# EAGLE board Mixer (EAGLE 9.6.2)
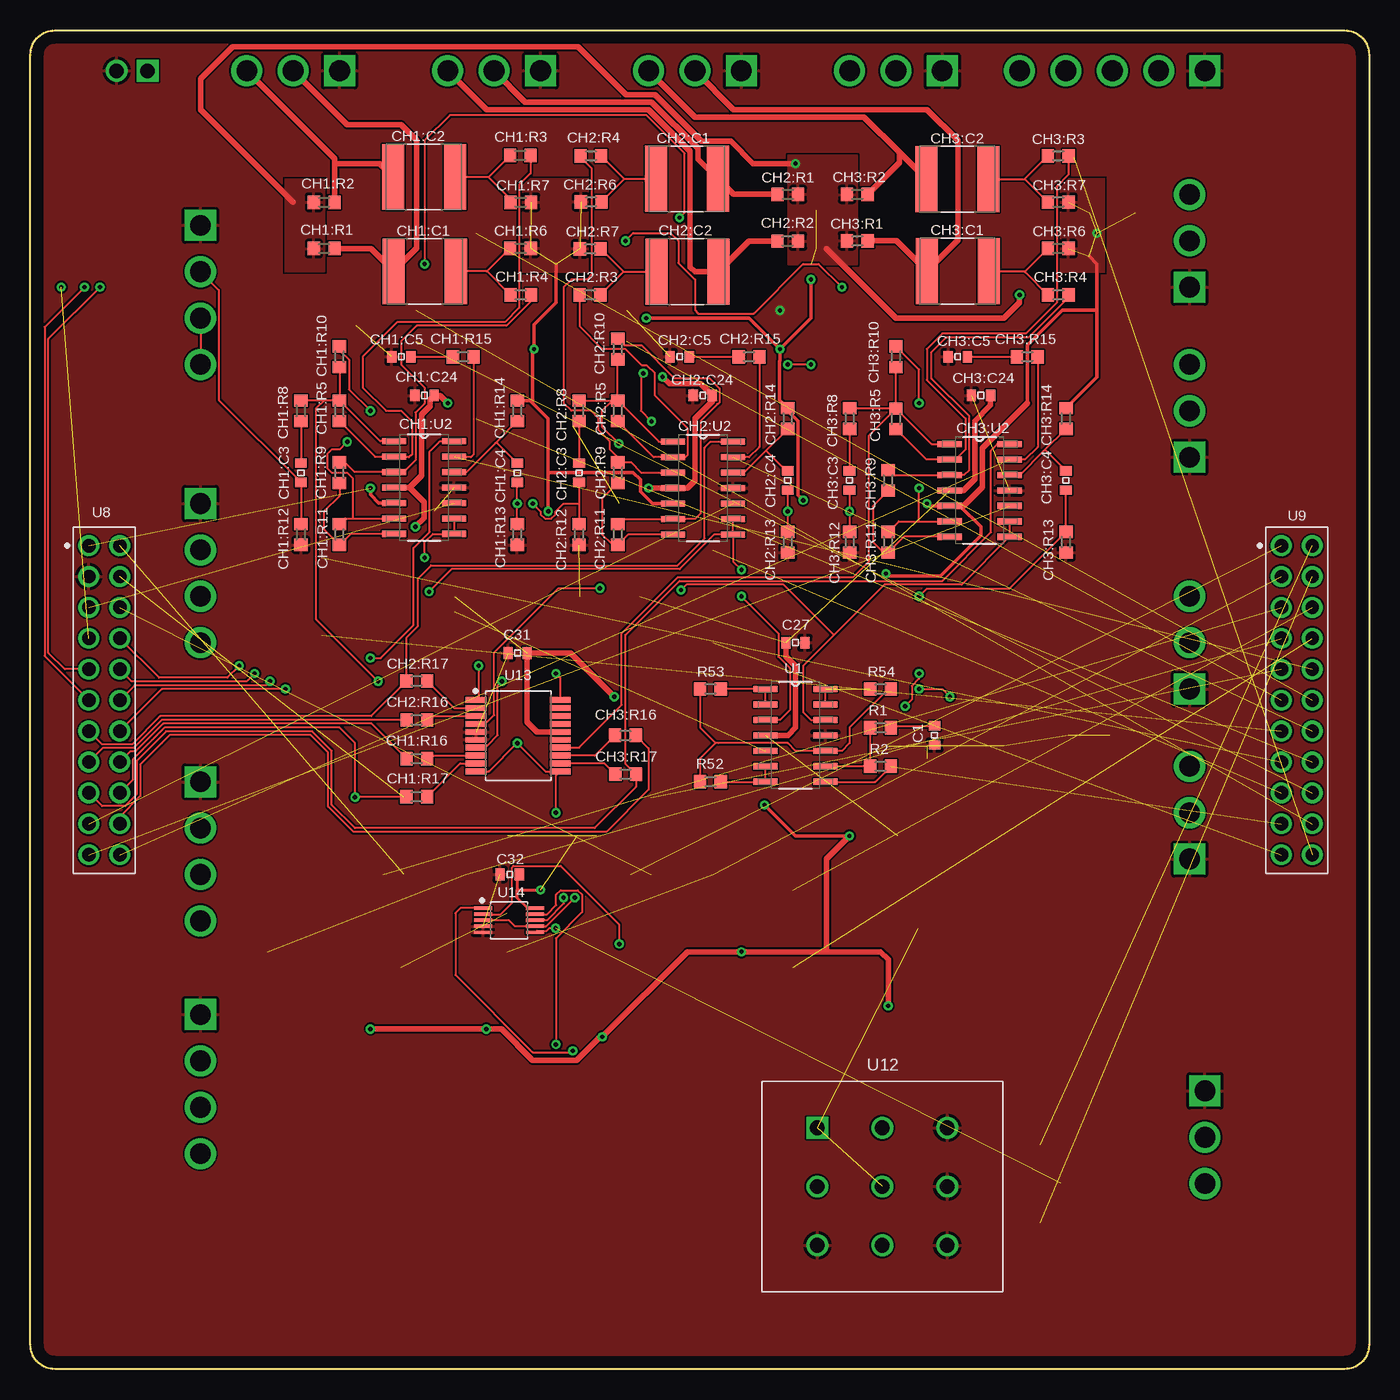
[diagram p6: board, top side]
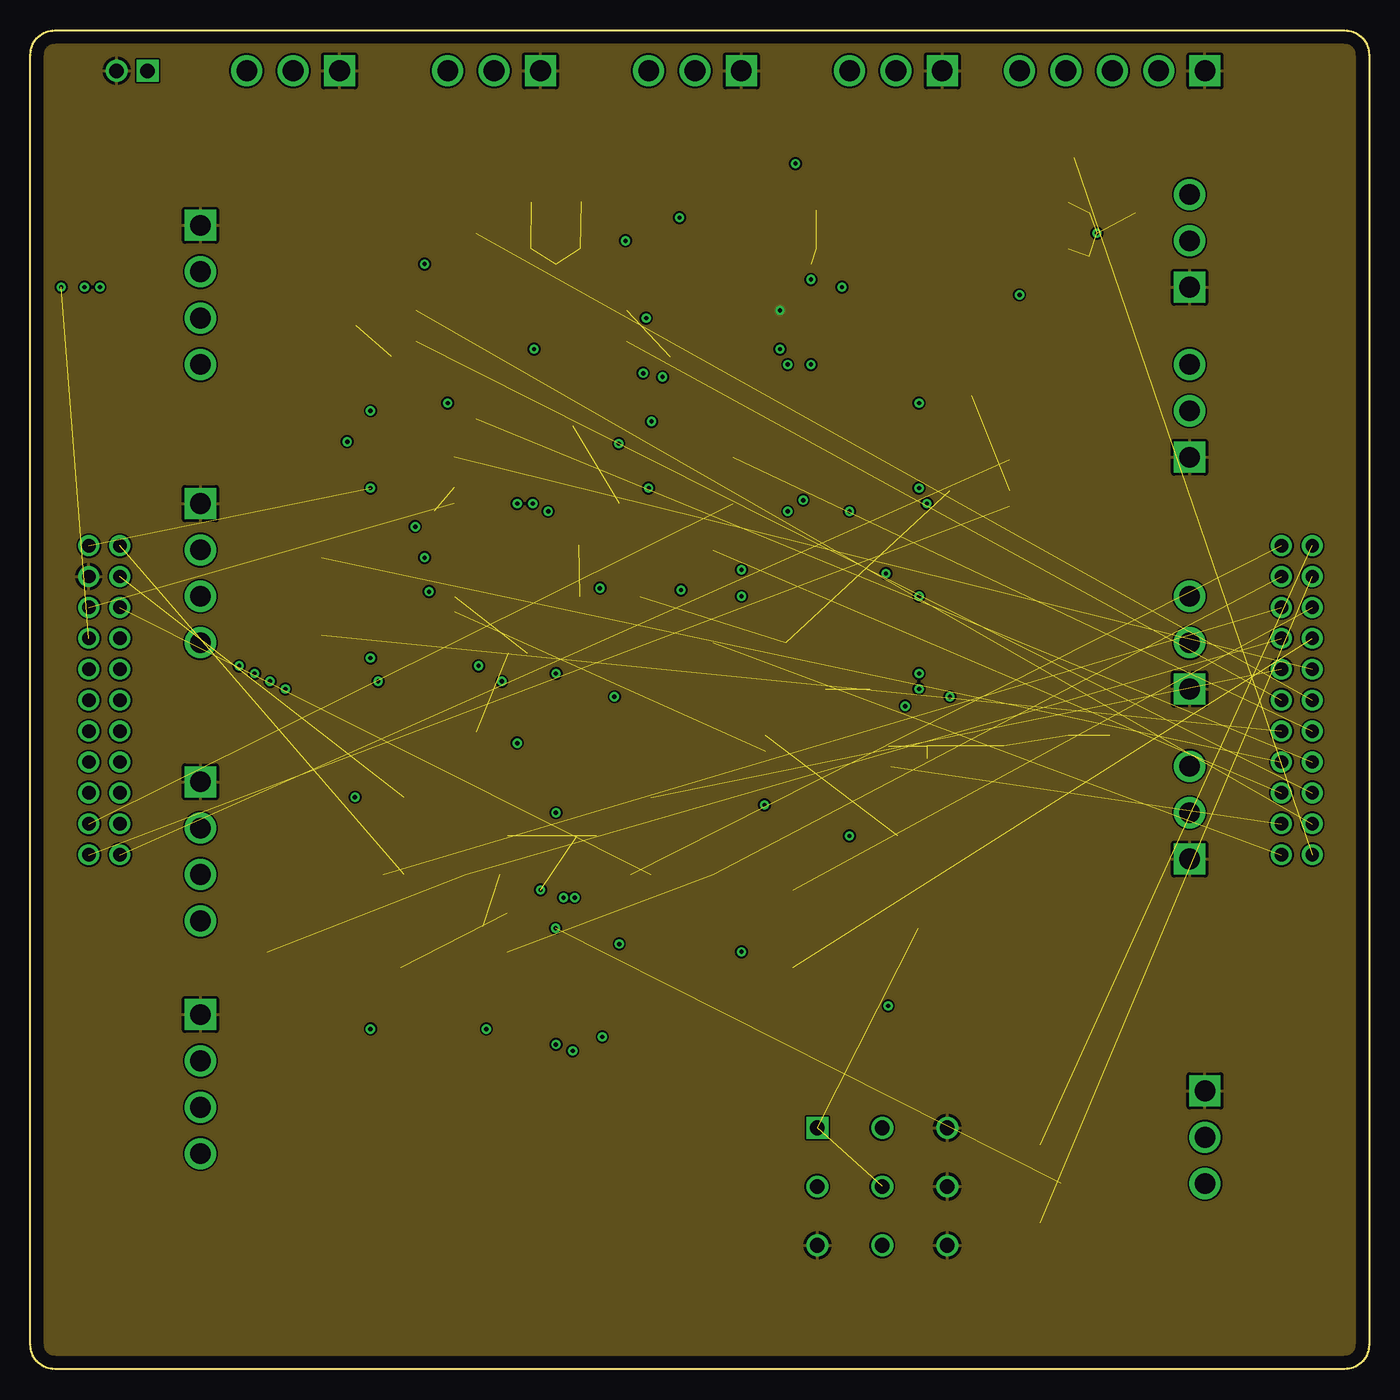
[diagram p7: board, inner layer UpperMiddle]
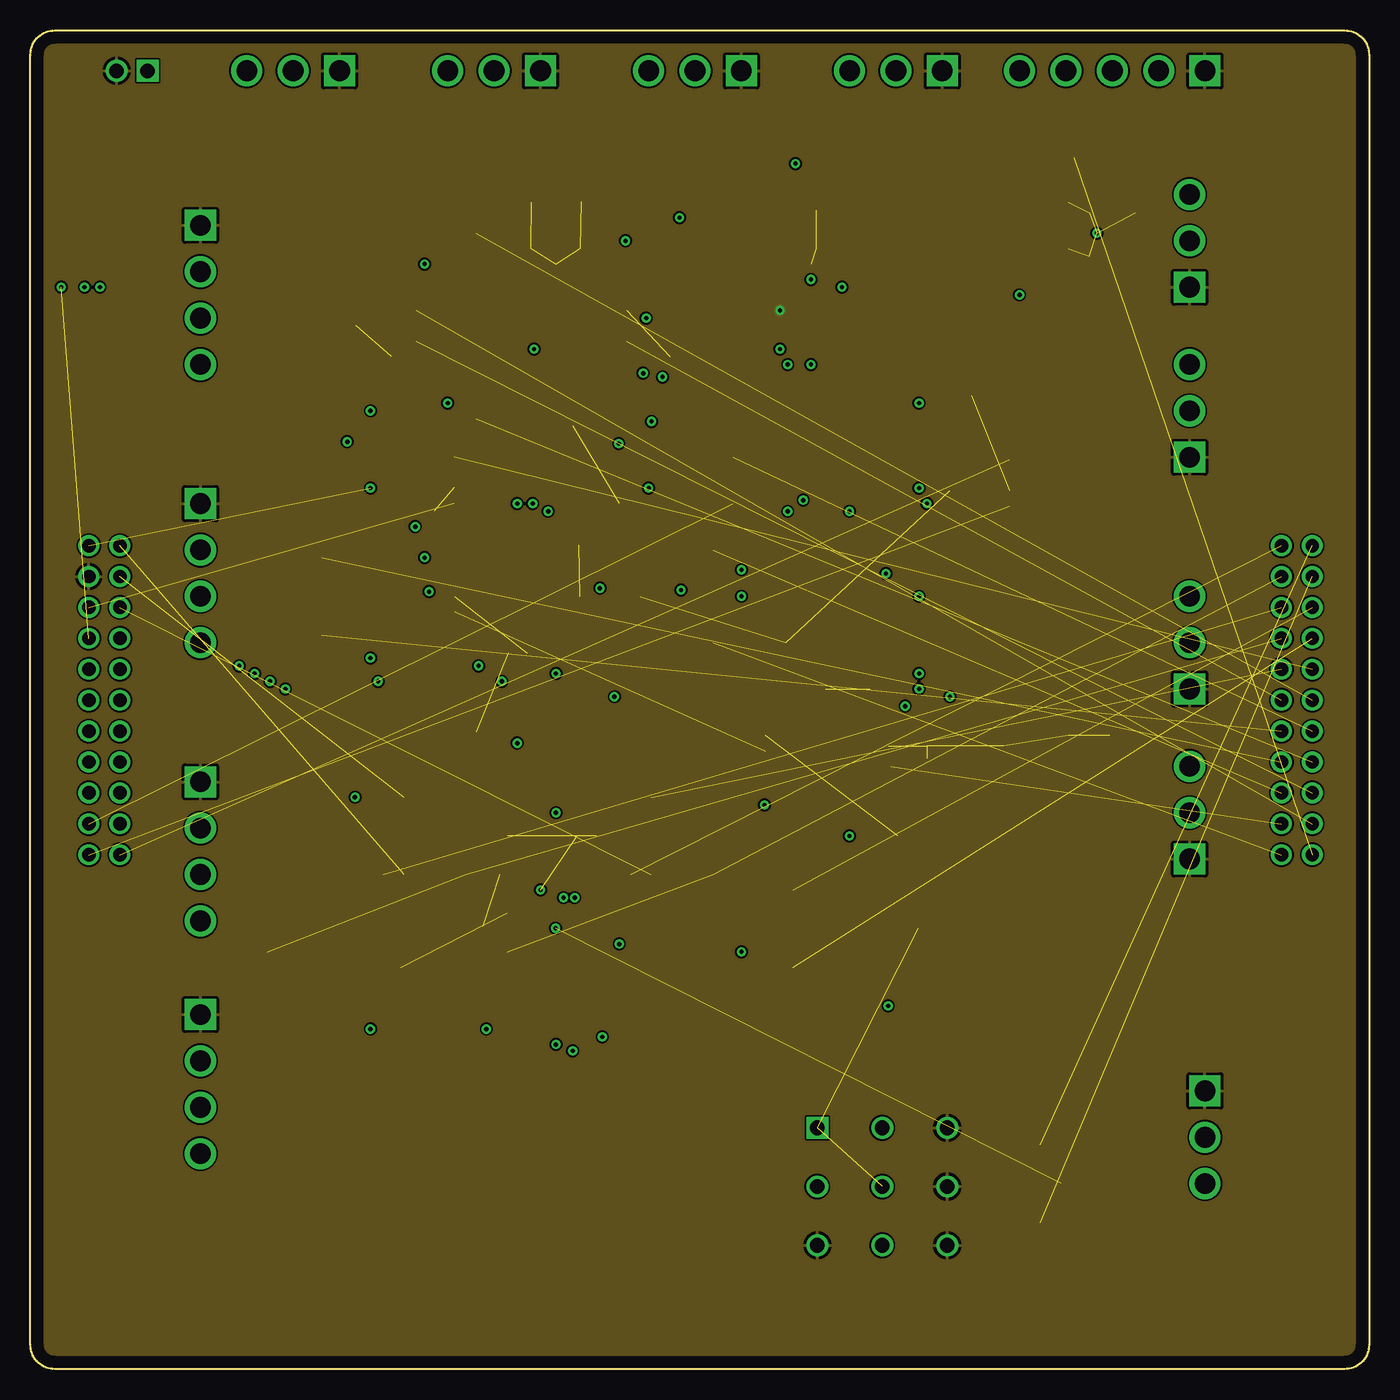
[diagram p8: board, inner layer LowerMiddle]
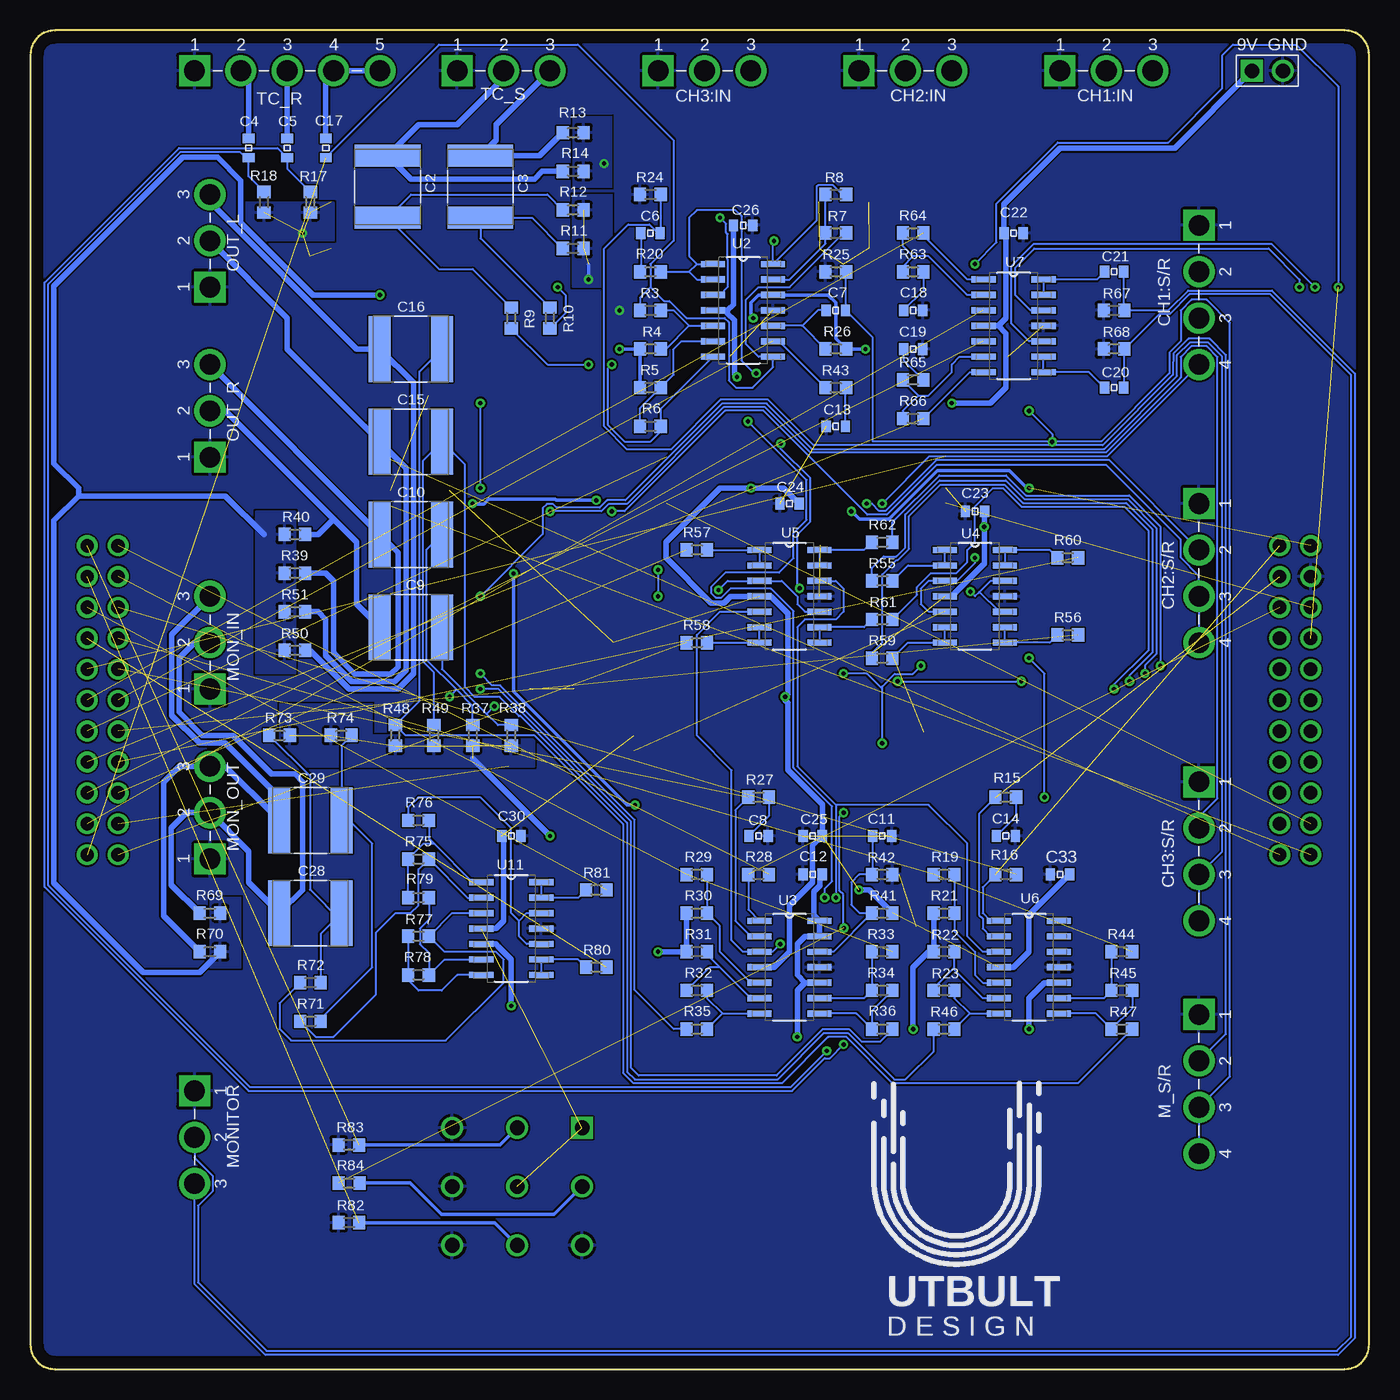
[diagram p9: board, bottom side, seen from below]

Size 110 x 110 mm. Coordinates in mm from the lower left corner, seen from the top.
Outline: 0,2 0,108 arc-90 2,110 108,110 arc-90 110,108 110,2 arc-90 108,0 2,0 arc-90 0,2
Copper layers (1*16): Top 0.035mm / dielectric 1.5mm / Bottom 0.035mm
Design rules "default *": minimum track width 6mil, minimum drill 0.35mm, track to track 6mil, track to pad 6mil, pad to pad 6mil, via to via 6mil, smd to smd 6mil, copper to edge 40mil, drill to drill 6mil, minimum pad ring 10mil, minimum via ring 8mil, stop-mask expansion 4mil, vias tented up to drill 0mil, thermal gap 10mil

## Footprints (pad centres in the part's own frame; a part is rotated, then mirrored left to right if it is on the bottom)
0603 = smd 0.762 x 0.965: 1 -0.787,0; 2 0.787,0
2220 = smd 1.81 x 5.41: 1 -2.55,0; 2 2.55,0
3_PIN_PORT = drill 1.702 square: P$1 0,0 | drill 1.702: P$2 3.81,0; P$3 7.62,0
R0603 = smd 1 x 1.1: 1 -0.85,0; 2 0.85,0
4_PIN_PORT = drill 1.702 square: P$1 -2.54,0 | drill 1.702: P$2 1.27,0; P$3 5.08,0; P$4 8.89,0
SOIC127P600X175-14N = smd 1.981 x 0.508: 1 -2.464,3.81; 2 -2.464,2.54; 3 -2.464,1.27; 4 -2.464,0; 5 -2.464,-1.27; 6 -2.464,-2.54; 7 -2.464,-3.81; 8 2.464,-3.81; 9 2.464,-2.54; 10 2.464,-1.27; 11 2.464,0; 12 2.464,1.27; 13 2.464,2.54; 14 2.464,3.81
5_PIN_PORT = drill 1.702 square: P$1 0,0 | drill 1.702: P$2 3.81,0; P$3 7.62,0; P$4 11.43,0; P$5 15.24,0
HDRV22W64P254_2X11_2794X508X838B = drill 1.105 pad 1.705: 1 -12.7,-1.27; 2 -10.16,-1.27; 3 -7.62,-1.27; 4 -5.08,-1.27; 5 -2.54,-1.27; 6 0,-1.27; 7 2.54,-1.27; 8 5.08,-1.27; 9 7.62,-1.27; 10 10.16,-1.27; 11 12.7,-1.27; 12 12.7,1.27; 13 10.16,1.27; 14 7.62,1.27; 15 5.08,1.27; 16 2.54,1.27; 17 0,1.27; 18 -2.54,1.27; 19 -5.08,1.27; 20 -7.62,1.27; 21 -10.16,1.27; 22 -12.7,1.27
POWER = drill 1.2 square: P$1 -1.27,0 | drill 1.2: P$2 1.27,0
FS57003PLT2B2M1QE = drill 1.2 square: P$1 -5.334,4.826 | drill 1.2: P$2 -5.334,0; P$3 -5.334,-4.826; P$4 0,4.826; P$5 0,0; P$6 0,-4.826; P$7 5.334,4.826; P$8 5.334,0; P$9 5.334,-4.826
SOP65P777X173-20N = smd 1.7 x 0.481: 1 -3.462,2.925; 2 -3.462,2.275; 3 -3.462,1.625; 4 -3.462,0.975; 5 -3.462,0.325; 6 -3.462,-0.325; 7 -3.462,-0.975; 8 -3.462,-1.625; 9 -3.462,-2.275; 10 -3.462,-2.925; 11 3.462,-2.925; 12 3.462,-2.275; 13 3.462,-1.625; 14 3.462,-0.975; 15 3.462,-0.325; 16 3.462,0.325; 17 3.462,0.975; 18 3.462,1.625; 19 3.462,2.275; 20 3.462,2.925
SOP50P490X110-10N = smd 1.471 x 0.283: 1 -2.15,1; 2 -2.15,0.5; 3 -2.15,0; 4 -2.15,-0.5; 5 -2.15,-1; 6 2.15,-1; 7 2.15,-0.5; 8 2.15,0; 9 2.15,0.5; 10 2.15,1

## Placement (x,y rotation side)
C1  4.7u  [0603]  74.3,52.07 270 top
C2  22u / 63V  [2220]  80.64,97.16 90 bottom
C3  22u / 63V  [2220]  73.03,97.16 90 bottom
C4  22u / 10V  [0603]  92.08,100.33 270 bottom
C5  22u / 10V  [0603]  88.9,100.33 270 bottom
C6  22u / 10V  [0603]  59.05,93.34 0 bottom
C7  22u / 10V  [0603]  43.81,87 180 bottom
C8  4.7u  [0603]  50.16,43.81 0 bottom
C9  22u / 63V  [2220]  78.74,60.96 180 bottom
C10  22u / 63V  [2220]  78.74,68.58 180 bottom
C11  10u  [0603]  40.01,43.81 0 bottom
C12  10u  [0603]  45.72,40.64 180 bottom
C13  4.7u  [0603]  43.81,77.47 180 bottom
C14  4.7u  [0603]  29.84,43.81 0 bottom
C15  22u / 63V  [2220]  78.74,76.2 180 bottom
C16  22u / 63V  [2220]  78.74,83.82 180 bottom
C17  22u / 10V  [0603]  85.72,100.33 270 bottom
C18  4.7u  [0603]  37.47,87 0 bottom
C19  4.7u  [0603]  37.47,83.82 0 bottom
C20  22u / 10V  [0603]  20.95,80.64 0 bottom
C21  22u / 10V  [0603]  20.95,90.17 0 bottom
C22  10u / 16V  [0603]  29.21,93.34 180 bottom
C23  10u / 16V  [0603]  32.38,70.48 0 bottom
C24  10u / 16V  [0603]  47.62,71.12 0 bottom
C25  10u / 16V  [0603]  45.72,43.81 0 bottom
C26  10u / 16V  [0603]  51.44,93.98 180 bottom
C27  10u / 16V  [0603]  62.87,59.69 180 top
C28  22u / 63V  [2220]  87,37.47 0 bottom
C29  22u / 63V  [2220]  87,45.09 0 bottom
C30  10u / 16V  [0603]  70.48,43.81 180 bottom
C31  100n/16V  [0603]  40.03,58.83 180 top
C32  100n/16V  [0603]  39.38,40.64 180 top
C33  10u / 16V  [0603]  25.4,40.64 0 bottom
CH1:C1  22u / 63V  [2220]  32.41,90.2 0 top
CH1:C2  22u / 63V  [2220]  32.34,97.96 0 top
CH1:C3  22u / 10V  [0603]  22.23,73.66 270 top
CH1:C4  22u / 10V  [0603]  40.01,73.66 90 top
CH1:C5  4.7u  [0603]  30.48,83.19 180 top
CH1:C24  10u / 16V  [0603]  32.38,80.01 0 top
CH1:IN  XLR_Female  [3_PIN_PORT]  25.4,106.68 0 bottom
CH1:R1  100k  [R0603]  24.14,92.08 180 top
CH1:R2  100k  [R0603]  24.14,95.88 180 top
CH1:R3  10k  [R0603]  40.25,99.73 0 top
CH1:R4  10k  [R0603]  40.29,88.27 180 top
CH1:R5  10k  [R0603]  25.4,78.74 90 top
CH1:R6  100k  [R0603]  40.27,92.09 180 top
CH1:R7  100k  [R0603]  40.29,95.88 180 top
CH1:R8  100R  [R0603]  22.23,78.74 270 top
CH1:R9  10k  [R0603]  25.4,73.66 90 top
CH1:R10  10k  [R0603]  25.4,83.19 270 top
CH1:R11  10k  [R0603]  25.4,68.58 90 top
CH1:R12  100k  [R0603]  22.23,68.58 90 top
CH1:R13  100k  [R0603]  40.01,68.58 90 top
CH1:R14  100k  [R0603]  40.01,78.74 270 top
CH1:R15  10k  [R0603]  35.56,83.19 0 top
CH1:R16  10k  [R0603]  31.75,50.16 180 top
CH1:R17  100R  [R0603]  31.74,47.03 0 top
CH1:S/R  Switchable_jack  [4_PIN_PORT]  13.97,91.44 270 bottom
CH1:U2  TL074IDT  [SOIC127P600X175-14N]  32.35,72.44 0 top
CH2:C1  22u / 63V  [2220]  53.95,97.8 180 top
CH2:C2  22u / 63V  [2220]  53.99,90.17 180 top
CH2:C3  22u / 10V  [0603]  45.09,73.66 270 top
CH2:C4  22u / 10V  [0603]  62.23,73.03 90 top
CH2:C5  4.7u  [0603]  53.34,83.19 180 top
CH2:C24  10u / 16V  [0603]  55.24,80.01 0 top
CH2:IN  XLR_Female  [3_PIN_PORT]  41.91,106.68 0 bottom
CH2:R1  100k  [R0603]  62.23,96.53 0 top
CH2:R2  100k  [R0603]  62.23,92.68 0 top
CH2:R3  10k  [R0603]  45.97,88.27 180 top
CH2:R4  10k  [R0603]  46.05,99.69 0 top
CH2:R5  10k  [R0603]  48.26,78.74 90 top
CH2:R6  100k  [R0603]  46.08,95.91 0 top
CH2:R7  100k  [R0603]  46,92.05 0 top
CH2:R8  100R  [R0603]  45.09,78.74 270 top
CH2:R9  10k  [R0603]  48.26,73.66 90 top
CH2:R10  10k  [R0603]  48.26,83.82 270 top
CH2:R11  10k  [R0603]  48.26,68.58 90 top
CH2:R12  100k  [R0603]  45.09,68.58 90 top
CH2:R13  100k  [R0603]  62.23,67.94 90 top
CH2:R14  100k  [R0603]  62.23,78.11 270 top
CH2:R15  10k  [R0603]  59.05,83.19 0 top
CH2:R16  10k  [R0603]  31.75,53.34 180 top
CH2:R17  100R  [R0603]  31.74,56.54 0 top
CH2:S/R  Switchable_jack  [4_PIN_PORT]  13.97,68.58 270 bottom
CH2:U2  TL074IDT  [SOIC127P600X175-14N]  55.27,72.4 0 top
CH3:C1  22u / 63V  [2220]  76.2,90.22 0 top
CH3:C2  22u / 63V  [2220]  76.16,97.77 0 top
CH3:C3  22u / 10V  [0603]  67.31,73.03 270 top
CH3:C4  22u / 10V  [0603]  85.09,73.03 90 top
CH3:C5  4.7u  [0603]  76.2,83.19 180 top
CH3:C24  10u / 16V  [0603]  78.11,80.01 0 top
CH3:IN  XLR_Female  [3_PIN_PORT]  58.42,106.68 0 bottom
CH3:R1  100k  [R0603]  67.94,92.71 180 top
CH3:R2  100k  [R0603]  67.94,96.52 180 top
CH3:R3  10k  [R0603]  84.45,99.69 0 top
CH3:R4  10k  [R0603]  84.45,88.27 180 top
CH3:R5  10k  [R0603]  71.12,78.08 90 top
CH3:R6  100k  [R0603]  84.45,92.08 180 top
CH3:R7  100k  [R0603]  84.45,95.89 180 top
CH3:R8  100R  [R0603]  67.31,78.11 270 top
CH3:R9  10k  [R0603]  70.48,73.03 90 top
CH3:R10  10k  [R0603]  71.12,83.19 270 top
CH3:R11  10k  [R0603]  70.48,67.94 90 top
CH3:R12  100k  [R0603]  67.31,67.94 90 top
CH3:R13  100k  [R0603]  85.09,67.94 90 top
CH3:R14  100k  [R0603]  85.09,78.11 270 top
CH3:R15  10k  [R0603]  81.92,83.19 0 top
CH3:R16  10k  [R0603]  48.9,52.07 0 top
CH3:R17  100R  [R0603]  48.9,48.88 180 top
CH3:S/R  Switchable_jack  [4_PIN_PORT]  13.97,45.72 270 bottom
CH3:U2  TL074IDT  [SOIC127P600X175-14N]  78,72.2 0 top
M_S/R  Switchable_jack  [4_PIN_PORT]  13.97,26.59 270 bottom
MON_IN  XLR_Female  [3_PIN_PORT]  95.25,55.88 90 bottom
MON_OUT  XLR_Male  [3_PIN_PORT]  95.25,41.91 90 bottom
MONITOR  Stereojack  [3_PIN_PORT]  96.52,22.86 270 bottom
OUT_L  XLR_Male  [3_PIN_PORT]  95.25,88.9 90 bottom
OUT_R  XLR_Male  [3_PIN_PORT]  95.25,74.93 90 bottom
R1  10k  [R0603]  69.85,52.7 180 top
R2  5k  [R0603]  69.85,49.53 0 top
R3  10k  [R0603]  59.05,87 0 bottom
R4  10k  [R0603]  59.05,83.82 0 bottom
R5  10k  [R0603]  59.05,80.64 0 bottom
R6  10k  [R0603]  59.05,77.47 0 bottom
R7  10k  [R0603]  43.81,93.34 180 bottom
R8  10k  [R0603]  43.81,96.52 0 bottom
R9  100R  [R0603]  70.48,86.36 90 bottom
R10  100R  [R0603]  67.31,86.36 90 bottom
R11  100k  [R0603]  65.41,92.08 180 bottom
R12  100k  [R0603]  65.41,95.25 180 bottom
R13  100k  [R0603]  65.41,101.6 180 bottom
R14  100k  [R0603]  65.41,98.42 180 bottom
R15  10k  [R0603]  29.84,46.99 180 bottom
R16  10k  [R0603]  29.84,40.64 0 bottom
R17  100k  [R0603]  87,95.89 90 bottom
R18  100k  [R0603]  90.81,95.89 90 bottom
R19  10k  [R0603]  34.92,40.64 0 bottom
R20  100R  [R0603]  59.05,90.17 180 bottom
R21  10k  [R0603]  34.92,37.47 0 bottom
R22  10k  [R0603]  34.92,34.29 0 bottom
R23  10k  [R0603]  34.92,31.11 0 bottom
R24  100k  [R0603]  59.05,96.52 0 bottom
R25  100k  [R0603]  43.81,90.17 0 bottom
R26  100k  [R0603]  43.81,83.82 180 bottom
R27  10k  [R0603]  50.16,46.99 180 bottom
R28  10k  [R0603]  50.16,40.64 0 bottom
R29  10k  [R0603]  55.24,40.64 0 bottom
R30  10k  [R0603]  55.24,37.47 0 bottom
R31  10k  [R0603]  55.24,34.29 0 bottom
R32  10k  [R0603]  55.24,31.11 0 bottom
R33  10k  [R0603]  40.01,34.29 180 bottom
R34  10k  [R0603]  40.01,31.11 0 bottom
R35  100R  [R0603]  55.24,27.94 180 bottom
R36  100R  [R0603]  40.01,27.94 0 bottom
R37  100k  [R0603]  73.66,52.07 90 bottom
R38  100k  [R0603]  70.48,52.07 90 bottom
R39  100k  [R0603]  88.27,65.41 0 bottom
R40  100k  [R0603]  88.27,68.58 0 bottom
R41  100k  [R0603]  40.01,37.47 0 bottom
R42  100k  [R0603]  40.01,40.64 180 bottom
R43  10k  [R0603]  43.81,80.64 180 bottom
R44  10k  [R0603]  20.32,34.29 180 bottom
R45  10k  [R0603]  20.32,31.11 0 bottom
R46  100R  [R0603]  34.92,27.94 180 bottom
R47  100R  [R0603]  20.32,27.94 0 bottom
R48  100k  [R0603]  80.01,52.07 90 bottom
R49  100k  [R0603]  76.83,52.07 90 bottom
R50  100k  [R0603]  88.27,59.05 0 bottom
R51  100k  [R0603]  88.27,62.23 0 bottom
R52  100R  [R0603]  55.88,48.26 180 top
R53  100R  [R0603]  55.88,55.88 180 top
R54  100R  [R0603]  69.85,55.88 0 top
R55  100R  [R0603]  40.01,64.77 180 bottom
R56  100R  [R0603]  24.77,60.33 0 bottom
R57  100R  [R0603]  55.24,67.31 180 bottom
R58  100R  [R0603]  55.24,59.69 180 bottom
R59  100R  [R0603]  40.01,58.42 180 bottom
R60  100R  [R0603]  24.77,66.67 0 bottom
R61  100R  [R0603]  40.01,61.59 0 bottom
R62  100R  [R0603]  40.01,67.94 0 bottom
R63  10k  [R0603]  37.47,90.17 180 bottom
R64  5k  [R0603]  37.47,93.34 0 bottom
R65  10k  [R0603]  37.47,81.28 180 bottom
R66  5k  [R0603]  37.47,78.11 0 bottom
R67  100k  [R0603]  20.95,87 0 bottom
R68  100k  [R0603]  20.95,83.82 0 bottom
R69  100k  [R0603]  95.25,37.47 0 bottom
R70  100k  [R0603]  95.25,34.29 0 bottom
R71  10k  [R0603]  87,28.57 180 bottom
R72  10k  [R0603]  87,31.75 0 bottom
R73  100k  [R0603]  89.53,52.07 180 bottom
R74  100k  [R0603]  84.45,52.07 0 bottom
R75  10k  [R0603]  78.11,41.91 180 bottom
R76  100R  [R0603]  78.11,45.09 180 bottom
R77  10k  [R0603]  78.11,35.56 0 bottom
R78  10k  [R0603]  78.11,32.38 0 bottom
R79  10k  [R0603]  78.11,38.73 180 bottom
R80  100R  [R0603]  63.5,33.02 0 bottom
R81  100R  [R0603]  63.5,39.37 0 bottom
R82  10k  [R0603]  83.83,12.03 0 bottom
R83  10k  [R0603]  83.83,18.42 0 bottom
R84  1k  [R0603]  83.81,15.29 180 bottom
TC_R  Stereojack  [5_PIN_PORT]  96.52,106.68 0 bottom
TC_S  XLR_Male  [3_PIN_PORT]  74.93,106.68 0 bottom
U1  TL074IDT  [SOIC127P600X175-14N]  62.87,52.07 0 top
U2  TL074IDT  [SOIC127P600X175-14N]  51.44,87 0 bottom
U3  TL074IDT  [SOIC127P600X175-14N]  47.62,33.02 0 bottom
U4  TL074IDT  [SOIC127P600X175-14N]  32.38,63.5 0 bottom
U5  TL074IDT  [SOIC127P600X175-14N]  47.62,63.5 0 bottom
U6  TL074IDT  [SOIC127P600X175-14N]  27.94,33.02 0 bottom
U7  TL074IDT  [SOIC127P600X175-14N]  29.21,85.72 0 bottom
U8  22PINHEADER22PINHEADER  [HDRV22W64P254_2X11_2794X508X838B]  6.07,54.97 270 top
U9  22PINHEADER22PINHEADER  [HDRV22W64P254_2X11_2794X508X838B]  104.06,54.97 270 top
U10  POWER  [POWER]  8.35,106.68 0 bottom
U11  TL074IDT  [SOIC127P600X175-14N]  70.48,36.2 0 bottom
U12  3PDTSWITCH  [FS57003PLT2B2M1QE]  70,15 0 top
U13  ISL43240IAZ  [SOP65P777X173-20N]  40.08,52.04 0 top
U14  ISL43410IUZ  [SOP50P490X110-10N]  39.33,36.88 0 top
U$1  UTBULT_DESIGN4  [UD_4]  33.94,16.57 0 bottom

## Tracks (layer width: path | path; a pad name or v marks a point on that pad's centre or on a via)
+9V  (via drill 0.35)  (8 unrouted)
  Top 0.254: U14.10 40.86,37.88 40.01,38.73 40.01,39.37 | 40.01,39.37 40.01,40.47 C32.1 | 40.01,39.37 v41.91,39.37
  Top 0.457: CH3:C24.2 78.89,79.21 77.6,77.92 77.6,73.15 76.64,72.2 CH3:U2.4 | CH2:U2.4 53.98,72.39 54.61,73.03 54.61,78.11 56.03,79.53 CH2:C24.2 55.08,80.97 52.5,80.97 v51.94,81.52 | CH2:U2.4 | 31.17,72.44 32.14,73.42 32.14,78.45 32.84,79.15 32.84,79.68 CH1:C24.2 33.66,80.01 v34.29,79.38 | CH1:U2.4 31.17,72.44 | U13.16 41.62,52.37 40.82,53.16 C31.1 44.4,58.83 v47.98,55.24 | C27.2 62.08,58.57 62.87,57.78 62.87,52.7 62.23,52.07 U1.4 | 31.17,72.44 32.35,71.26 32.35,69.94 v31.63,69.22 | v50.8,72.39 CH2:U2.4
  Bottom 0.457: U3.4 48.9,33.02 47.62,34.29 47.62,38.1 45.72,40.01 45.72,43.03 C25.2 44.93,46.4 47.75,49.21 47.75,54.74 47.98,54.97 v47.98,55.24 47.75,55.48 47.75,62.09 49.17,63.5 U5.4 52.47,63.5 53.01,62.96 54.07,62.96 57.78,66.67 57.78,67.94 53.34,72.39 v50.8,72.39 48.11,72.39 C24.2 | C33.2 27.94,37.31 27.94,34.29 29.21,33.02 U6.4 | C26.2 52.22,87.48 52.7,87 | 52.7,87 U2.4 | U11.4 71.75,36.2 71.12,36.83 71.12,43.66 C30.2 | R41.2 41.06,39.37 v41.91,39.37 | C23.2 31.63,70.46 v31.63,69.22 31.63,66.21 34.34,63.5 U4.4 | U10.P$1 15.97,100.33 25.4,100.33 30,95.73 C22.2 29.84,93.19 29.84,86.36 30.48,85.72 | 30.48,85.72 U7.4 | 30.48,85.72 29.84,85.09 29.84,80.64 31.11,79.38 v34.29,79.38 | 52.7,87 52.7,86.75 52.16,86.2 52.16,81.74 v51.94,81.52
CH1:N$1
  Top 0.457: CH1:IN.P$3 24.99,99.47 24.99,99.06 | 24.99,99.06 CH1:R2.1 | 24.99,99.06 28.68,99.06 CH1:C2.1
CH1:N$2
  Top 0.457: CH1:IN.P$2 26.04,102.23 30.48,102.23 31.75,100.97 31.75,92.09 CH1:C1.1 27.98,92.08 CH1:R1.1
CH1:N$3
  Top 0.152: CH1:R4.1 41.14,87.76 39.11,85.72 31.75,85.72 30.48,84.45 30.48,82.55 32.38,80.64 32.38,79.34 31.65,78.6 31.65,74.68 30.68,73.71 CH1:U2.3 26.62,73.71 25.82,74.51 CH1:R9.2
CH1:N$4
  Top 0.152: CH1:R5.1 28.31,74.98 CH1:U2.2 29.93,74.93 31.11,74.93 31.34,75.16 31.34,77.88 30.48,78.74 29.21,78.74 27.3,80.64 27.3,83.19 30.15,86.03 32.92,86.03 33.02,86.03 38.98,86.03 40.17,87.22 40.17,97.32 41.1,98.25 CH1:R3.2
CH1:N$5
  Top 0.152: CH1:R3.1 37.64,97.96 | 37.64,97.96 CH1:C2.2 | CH1:R7.2 39.44,96.15 37.64,97.96
CH1:N$6
  Top 0.152: CH1:R6.2 37.52,90.2 37.51,90.2 | CH1:C1.2 37.47,90.2 37.51,90.2 | CH1:R4.2 37.51,90.2
CH1:N$7  (via drill 0.35)
  Top 0.152: CH1:R11.2 25.87,69.9 26.47,69.9 | 26.47,69.9 CH1:U2.6 | CH1:R10.1 25.4,83.71 26.18,82.93 26.18,80.5 v27.94,78.74 | v26.04,76.2 25.4,75.56 24.77,75.56 24.38,75.18 24.38,74.04 24.77,73.66 26.04,73.66 26.47,73.23 26.47,69.9
  Bottom 0.152: v27.94,78.74 26.04,76.83 v26.04,76.2
CH1:N$8
  Top 0.152: CH1:U2.7 26.3,68.63 CH1:R11.1 24.13,69 24.13,70.48 25.4,71.75 CH1:R9.1
CH1:N$10
  Top 0.152: CH1:R12.2 CH1:C3.2 15.47,79.62 15.47,88.67 CH1:S/R.P$2
CH1:N$11  (via drill 0.35)
  Top 0.152: CH1:R13.2 v40.01,71.12 CH1:C4.1 | CH1:S/R.P$3 CH1:S/R.P$4
  Bottom 0.152: v40.01,71.12 36.12,75.01 21.51,75.01 CH1:S/R.P$4
CH1:N$12
  Top 0.152: CH1:R14.2 38.21,76.09 | 38.21,76.09 35.82,73.71 CH1:U2.12 | CH1:C4.2 38.36,76.09 38.21,76.09
CH1:N$14
  Top 0.152: CH1:C5.1 CH1:R15.1
CH1:N$15
  Top 0.152: CH1:R8.2 CH1:C3.1
CH1_OUT  (via drill 0.35)  (1 unrouted)
  Top 0.152: v32.38,66.67 32.38,67.94 33.07,68.63 CH1:U2.8 CH1:U2.9
  Bottom 0.152: v32.38,66.67 32.38,66.24 33.86,64.77 U4.3 36.2,64.77 36.83,64.14 36.83,62.87 36.2,62.23 U4.5
CH2:N$1
  Top 0.457: CH2:IN.P$3 37.47,103.5 50.8,103.5 54.22,100.09 54.22,90.56 54.61,90.17 CH2:C2.1 59.05,92.68 CH2:R2.1
CH2:N$2
  Top 0.457: CH2:IN.P$2 40.66,104.11 51.05,104.11 54.86,100.3 54.86,99.44 CH2:C1.1 57.78,96.53 CH2:R1.1
CH2:N$3
  Top 0.152: CH2:U2.3 50.18,73.67 49.34,74.51 CH2:R9.2 48.26,74.93 47.62,75.56 47.62,76.2 46.69,77.14 46.69,78.11 46.05,78.74 44.45,78.74 43.81,79.38 43.81,88.9 44.45,89.53 45.72,89.53 46.12,89.94 46.12,98.66 45.2,99.58 CH2:R4.1
CH2:N$4
  Top 0.152: CH2:R5.1 51.22,74.94 CH2:U2.2 53.81,74.94 54.03,75.15 54.03,77.29 51.31,80.01 51.31,81.83 50.66,82.47 50.24,82.47 48.9,83.82 46.99,83.82 45.12,85.69 CH2:R3.2
CH2:N$5
  Top 0.152: CH2:R7.2 48.73,90.17 | 48.73,90.17 CH2:C2.2 | CH2:R3.1 48.73,90.17
CH2:N$6
  Top 0.152: CH2:R6.2 48.82,97.8 | 48.82,97.8 CH2:C1.2 | CH2:R4.2 48.79,97.8 48.82,97.8
CH2:N$7
  Top 0.152: CH2:R11.2 48.69,69.86 CH2:U2.6 54.61,69.85 55.07,70.31 55.07,75.82 55.07,76.2 55.07,77.92 56.45,79.3 56.51,79.3 56.64,79.43 56.64,80.59 55.81,81.42 52.9,81.42 50.2,84.12 48.8,84.12 CH2:R10.1
CH2:N$8
  Top 0.152: CH2:U2.7 49.12,68.58 48.37,67.84 | 48.37,67.84 CH2:R11.1 | CH2:R9.1 46.99,71.54 46.99,68.58 47.73,67.84 48.37,67.84
CH2:N$10  (via drill 0.35)
  Top 0.152: CH2:C3.2 45.09,71.12 | 45.09,71.12 CH2:R12.2 | 45.09,71.12 43.81,71.12 43.15,70.46 43.15,70.23 42.8,69.88 42.29,69.88 41.94,70.23 41.94,70.46 v41.27,71.12
  Bottom 0.152: CH2:S/R.P$2 21.36,74.7 35.56,74.7 39.75,70.51 40.26,70.51 40.86,71.12 v41.27,71.12
CH2:N$11  (via drill 0.35)
  Top 0.152: CH2:R13.2 v62.23,70.48 CH2:C4.1
  Bottom 0.152: CH2:S/R.P$4 CH2:S/R.P$3 13.97,65.18 15.47,66.69 15.47,68.18 21.59,74.3 35.54,74.3 39.63,70.21 41.22,70.21 49.75,78.74 52.91,78.74 61.16,70.48 v62.23,70.48
CH2:N$12
  Top 0.152: CH2:R14.2 60.43,75.46 | 60.43,75.46 58.64,73.67 CH2:U2.12 | CH2:C4.2 62.08,73.81 60.43,75.46
CH2:N$14
  Top 0.152: CH2:C5.1 CH2:R15.1
CH2:N$15
  Top 0.152: CH2:R8.2 CH2:C3.1
CH2_OUT  (via drill 0.35)
  Top 0.152: v32.75,63.88 34.6,65.73 53.34,65.73 56.19,68.58 CH2:U2.8 | CH2:U2.8 CH2:U2.9 | CH2:U2.8 57.74,66.37 v58.42,65.68 | v58.42,63.5 61.47,60.45 61.47,58.53 62.41,57.6 62.41,54.15 61.59,53.34 U1.3
  Bottom 0.152: U4.12 31.11,64.77 32.02,63.86 | v32.75,63.88 32.38,63.51 32.02,63.86 | U4.10 30.39,62.23 32.02,63.86 | v58.42,65.68 v58.42,63.5
CH3:N$1
  Top 0.457: CH3:IN.P$3 54.61,102.87 68.51,102.87 71.4,99.98 | 71.4,99.98 CH3:C2.1 | CH3:R2.1 71.4,99.13 71.4,99.98
CH3:N$2
  Top 0.457: CH3:IN.P$2 57.78,103.5 73.66,103.5 76.2,100.97 76.2,92.76 CH3:C1.1 71.16,92.71 CH3:R1.1
CH3:N$3
  Top 0.152: CH3:R9.2 70.89,73.47 CH3:U2.3 76.72,73.47 77.14,73.89 77.14,78.32 74.05,81.41 74.05,83.58 75.26,84.78 82.04,84.78 85.31,88.05 CH3:R4.1
CH3:N$4
  Top 0.152: CH3:R5.1 73.61,74.74 CH3:U2.2 76.01,74.74 76.83,75.56 76.83,78.11 73.66,81.28 73.66,83.82 74.93,85.09 81.8,85.09 83.82,87.11 84.08,87.37 84.33,87.62 84.33,97.17 85.31,98.15 CH3:R3.2
CH3:N$5
  Top 0.152: CH3:C2.2 81.68,97.77 | 81.68,97.77 CH3:R3.1 | CH3:R7.2 81.72,97.77 81.68,97.77
CH3:N$6
  Top 0.152: CH3:C1.2 81.75,90.22 | 81.75,90.22 CH3:R6.2 | CH3:R4.2 81.75,90.12 81.75,90.22
CH3:N$7  (via drill 0.35)
  Top 0.152: CH3:R11.2 71.35,69.66 73.03,69.66 | 73.03,69.66 CH3:U2.6 | 73.03,69.66 v73.03,72.39 | v73.03,79.38 73.03,82.13 CH3:R10.1
  Bottom 0.152: v73.03,72.39 v73.03,79.38
CH3:N$8
  Top 0.152: CH3:U2.7 71.78,68.39 70.59,67.2 | 70.59,67.2 CH3:R11.1 | CH3:R9.1 69.22,70.91 69.22,67.94 69.96,67.2 70.59,67.2
CH3:N$10  (via drill 0.35)
  Top 0.152: CH3:C3.2 v67.31,70.48 CH3:R12.2
  Bottom 0.152: CH3:S/R.P$2 13.97,45.38 12.46,46.89 12.46,83.17 13.35,84.06 14.59,84.06 15.47,83.17 15.47,81.48 21.64,75.31 45.89,75.31 49.63,79.05 53.03,79.05 60.99,71.09 62.48,71.09 63.09,70.48 v67.31,70.48
CH3:N$11  (via drill 0.35)
  Top 0.152: CH3:C4.1 CH3:R13.2 80.43,64.14 73.66,64.14 v73.03,63.5
  Bottom 0.152: CH3:S/R.P$4 CH3:S/R.P$3 12.06,42.55 12.06,83.2 13.22,84.36 14.72,84.36 15.78,83.3 15.78,81.6 21.77,75.62 45.77,75.62 49.5,79.35 53.16,79.35 61.11,71.4 62.61,71.4 63.21,70.79 66.76,70.79 67.06,71.09 67.56,71.09 67.92,70.74 67.92,68.61 v73.03,63.5
CH3:N$12
  Top 0.152: CH3:R14.2 83.29,75.46 | 83.29,75.46 81.31,73.47 CH3:U2.12 | CH3:C4.2 83.44,75.46 83.29,75.46
CH3:N$14
  Top 0.152: CH3:C5.1 CH3:R15.1
CH3:N$15
  Top 0.152: CH3:R8.2 CH3:C3.1
CH3_OUT  (via drill 0.35)
  Top 0.152: CH3:U2.9 CH3:U2.8 76.54,64.47 70.18,64.47 66.04,60.33 | U1.12 64.14,53.34 63.5,53.98 63.5,57.78 66.04,60.33 | 66.04,60.33 61.9,64.47 53.89,64.47 v53.45,64.02
  Bottom 0.152: U5.10 46.35,62.23 46.99,62.87 46.99,63.5 48.26,64.77 U5.3 52.7,64.77 v53.45,64.02
GAIN1_P2  (1 unrouted)
  Bottom 0.152: R43.2 48.48,84.45 U2.9
GAIN1_P2_CH1  (1 unrouted)
  Top 0.152: CH1:R15.2 36.41,75.14 36.2,74.93 34.86,74.93 CH1:U2.13
GAIN1_P2_CH2  (1 unrouted)
  Top 0.152: CH2:R15.2 59.91,75.78 59.05,74.93 CH2:U2.13
GAIN1_P2_CH3  (1 unrouted)
  Top 0.152: CH3:R15.2 82.77,75.78 81.72,74.74 CH3:U2.13
GAIN1_P3_CH1  (via drill 0.35)
  Top 0.152: CH1:U2.14 33.66,76.25 32.8,75.4 32.8,68.8 31.48,67.47 31.48,61.12 28.78,58.42 v27.94,58.42 | CH1:R17.1 26.71,47.03 v26.67,46.99 26.67,51.44 25.4,52.7 11.02,52.7 8.42,50.1 8.42,49.53 8.42,49.44 8.42,48.43 U8.14
  Bottom 0.152: v26.67,46.99 26.67,57.15 v27.94,58.42
GAIN1_P3_CH2
  Top 0.152: CH2:U2.14 55.88,76.2 55.4,75.72 55.4,68.26 53.17,66.04 32.91,66.04 31.84,64.97 31.84,61.05 30.89,60.1 CH2:R17.1 28,53.65 10.67,53.65 8.37,51.34 6.35,51.34 6.26,51.34 5.88,51.34 U8.7
GAIN1_P3_CH3
  Top 0.152: CH3:U2.14 79.45,76.01 78.93,75.49 78.93,68.77 74.93,64.77 53.34,64.77 48.9,60.33 48.9,49.74 CH3:R17.1 49.75,47.85 46.35,44.45 26.67,44.45 24.77,46.35 24.77,50.8 23.16,52.4 11.15,52.4 8.73,49.98 8.73,47.2 7.79,46.26 5.88,46.26 U8.9
GAIN2_P2  (1 unrouted)
  Bottom 0.152: R27.2 52.07,45.94 52.07,36.83 50.8,35.56 U3.2
GAIN2_P3  (1 unrouted)
  Bottom 0.152: R28.1 51.02,37.76 U3.1
GAIN3_P2  (1 unrouted)
  Bottom 0.152: R15.2 32.05,45.63 32.05,37.34 31.75,37.03 31.75,36.2 31.11,35.56 U6.2
GAIN3_P3  (1 unrouted)
  Bottom 0.152: R16.1 31.75,39.59 31.75,37.47 31.11,36.83 U6.1
GND  (via drill 0.35)  (9 unrouted)
  other vias: 61.59,87
  pour UpperMiddle: 0,110.49 110.49,110.49 110.49,-0.64 0,-0.64
  pour LowerMiddle: 0,110.49 110.49,110.49 110.49,-1.27 0,-1.27
  pour Top (rank 6): 0,110.49 110.49,110.49 110.49,-0.64 0,-0.64
  pour Bottom (rank 6): 0,110.49 110.49,110.49 110.49,-0.64 0,-0.64 0,109.86
LED_GREEN  (1 unrouted)
  Bottom 0.305: R83.2 71.41,18.42 U12.P$4
LED_RED  (1 unrouted)
  Bottom 0.305: R82.2 71.86,12.04 U12.P$6
MASTER_BYP  (via drill 0.35)
  Top 0.152: U14.3 39.32,36.88 39.82,36.38 U14.7 42.37,36.38 v44.72,38.73 | v50.35,81.83 50.16,81.64 50.16,78.74 v51.03,77.87
  Bottom 0.152: R20.1 55.88,90.17 | 55.88,90.17 55.24,90.81 | 55.24,90.81 U2.1 53.98,90.88 | 55.88,90.17 55.24,89.53 U2.2 | v44.72,38.73 44.72,39.49 44.13,40.08 44.13,46.24 47.3,49.4 47.3,62.27 49.16,64.14 52.48,64.14 53.2,63.42 53.7,63.42 54.06,63.77 54.06,64.28 52.89,65.44 48.48,65.44 47.3,66.63 47.3,68.71 46.23,69.77 46.23,73.07 v51.03,77.87 | v50.35,81.83 50.53,81.83 51.59,82.88 51.59,94.77 52.07,95.25 55.24,95.25 55.88,94.61 55.88,91.44 55.24,90.81
MASTER_OUT_L  (via drill 0.35)
  Top 0.152: v43.81,38.73 43.81,38.26 42.44,36.88 U14.8
  Bottom 0.152: U5.12 43.81,64.77 43.18,64.14 43.18,62.23 43.81,61.59 46.35,61.59 46.99,60.96 46.99,49.53 43.81,46.35 | 43.81,46.35 v43.81,38.73 | U6.3 31.75,34.29 33.02,35.56 33.02,43.18 36.2,46.35 43.81,46.35
MASTER_OUT_R  (via drill 0.35)
  Top 0.152: U14.2 38.65,37.38 39.56,38.29 39.56,41.22 39.7,41.35 43.57,41.35 48.38,36.53 v48.38,34.92
  Bottom 0.152: v48.38,34.92 49.02,34.29 U3.3 51.44,34.29 52.38,35.23 52.38,49.2 55.24,52.07 55.24,60.33 53.34,62.23 U5.5
MASTER_RETURN_L  (via drill 0.35)
  Top 0.152: U14.9 42.46,37.38 43.21,38.13 43.21,38.99 43.56,39.34 44.98,39.34 45.33,38.99 45.33,37.56 43.18,35.41 v43.18,26.67
  Bottom 0.152: R17.2 88.9,98.64 C5.2 89.69,100.33 97.79,100.33 108.83,89.29 108.83,39.62 92.08,22.86 47.42,22.86 44.74,25.54 44.31,25.54 v43.18,26.67
MASTER_RETURN_R  (via drill 0.35)
  Top 0.152: U14.1 35.34,37.88 34.92,37.47 34.92,32.38 41.27,26.04 44.45,26.04 v44.56,26.15
  Bottom 0.152: R18.2 92.08,98 C4.2 92.33,99.54 92.81,100.03 97.66,100.03 108.53,89.16 108.53,39.74 91.95,23.16 47.54,23.16 v44.56,26.15
MASTER_VOLUME1_P2  (via drill 0.35)  (1 unrouted)
  Top 0.152: v53.34,94.61 53.76,95.03 53.76,99.9 50.61,103.05 34.47,103.05 32.38,100.97 v32.38,90.81
  Bottom 0.152: U2.3 53.34,88.27 52.68,88.92 52.68,91.15 52.7,91.18 52.7,93.28 52.83,93.4 52.83,94.11 v53.34,94.61 | v32.38,90.81 30.61,92.58 30.61,95.77 25.59,100.79 16.51,100.79 12.06,105.23 12.06,107.95 11.18,108.83 5.96,108.83 2.54,105.41 v2.54,88.9
MASTER_VOLUME1_P3  (1 unrouted)
  Top 0.152: U1.8 69.43,48.26 R2.2
MASTER_VOLUME2_P2  (2 unrouted)
MASTER_VOLUME2_P3  (1 unrouted)
MASTER_VOLUME2_P5  (2 unrouted)
MASTER_VOLUME2_P6  (1 unrouted)
MON_IN
  Bottom 0.152: U11.10 69.22,34.92 69.85,35.56 69.85,36.83 | 69.85,36.83 69.22,37.47 U11.12 | 69.85,36.83 70.48,37.47 70.48,44.45 73.03,46.99 78.11,46.99 78.95,46.14 R76.2
MONITOR_MIX_L  (1 unrouted)
MONITOR_MIX_R  (1 unrouted)
MONITOR_VOLUME1_P3  (via drill 0.35)
  Top 0.152: v19.68,56.52 19.36,56.19 8.56,56.19 U8.17
  Bottom 0.152: R59.2 40.85,58.84 40.01,59.69 40.01,65.29 38.82,66.48 38.72,66.48 37.8,67.4 37.8,70.1 35.22,72.68 29.95,72.68 28.44,71.17 19.97,71.17 17.8,69.01 17.8,58.89 19.68,57.01 v19.68,56.52
MONITOR_VOLUME1_P6  (via drill 0.35)
  Top 0.152: v18.41,57.15 17.78,56.52 8.33,56.52 U8.18
  Bottom 0.152: v18.41,57.15 18.41,57.82 17.49,58.75 17.49,69.13 19.84,71.48 28.32,71.48 29.86,73.03 35.3,73.03 38.1,70.23 38.1,67.53 38.84,66.78 39.9,66.78 40.85,65.83 R55.2
MONITOR_VOLUME2_P3  (1 unrouted)
MONITOR_VOLUME2_P6  (1 unrouted)
MONITOR_VOLUME3_P3  (via drill 0.35)
  Top 0.152: v20.95,55.88 10.79,55.88 U8.16
  Bottom 0.152: R61.2 37.13,63.62 37.13,64.26 35.99,65.41 33.92,65.41 33.02,66.3 33.02,67.31 32.38,67.94 32.38,70.88 30.89,72.38 30.08,72.38 28.57,70.87 20.09,70.87 18.12,68.9 18.12,59.06 20.95,56.23 v20.95,55.88
MONITOR_VOLUME3_P6  (1 unrouted)
MONITOR_VOLUME4_P3  (via drill 0.35)
  Top 0.152: v17.14,57.78 16.18,56.82 10.57,56.82 U8.19
  Bottom 0.152: R62.2 39.16,69.6 35.33,73.43 29.84,73.43 28.19,71.78 19.71,71.78 17.14,69.22 v17.14,57.78
MONITOR_VOLUME4_P6  (1 unrouted)
MONITOR_VOLUME5_P2  (via drill 0.35)
  Top 0.152: v4.45,88.9 1.17,85.62 1.17,58.6 U8.6
  Bottom 0.152: U7.10 27.94,84.45 29.39,85.9 29.39,90.63 27.54,92.47 8.02,92.47 v4.45,88.9
MONITOR_VOLUME5_P3  (1 unrouted)
  Bottom 0.152: R66.2 32.8,81.92 U7.7
MONITOR_VOLUME5_P5  (via drill 0.35)
  Top 0.152: U8.5 2.82,57.51 1.47,58.85 1.47,84.66 v5.71,88.9
  Bottom 0.152: U7.12 27.81,87 29.08,88.27 29.08,90.5 27.51,92.08 8.26,92.08 5.71,89.53 v5.71,88.9
MONITOR_VOLUME5_P6  (1 unrouted)
  Bottom 0.152: U7.1 33.02,89.53 36.62,93.13 R64.2
MONITOR_VOLUME6_P3  (1 unrouted)
MONITOR_VOLUME6_P6  (1 unrouted)
N$1
  Top 0.152: R53.2 55.03,52.7 56.3,51.44 | R52.2 55.03,50.16 56.3,51.44 | R54.2 70.48,55.88 67.31,52.7 67.31,51.44 66.67,50.8 U1.10 62.87,50.8 62.23,51.44 56.52,51.44 56.3,51.44
N$2
  Top 0.152: U1.9 R2.1 R1.2
N$3
  Bottom 0.152: C14.1 29,45.45 R15.1
N$4
  Top 0.152: R1.1 70.85,52.86 C1.1
N$5
  Bottom 0.152: R3.2 57.15,87 55.88,85.72 | R4.2 57.78,83.82 55.88,85.72 | 55.88,85.72 U2.5
N$6
  Bottom 0.152: U2.6 56.52,84.45 57.15,83.82 57.15,81.7 R5.2 59.91,78.94 R6.1
N$7  (via drill 0.35)
  Top 0.152: v64.14,82.55 v62.23,82.55
  Bottom 0.152: U2.7 58.2,78.88 R6.2 58.2,77.05 59.05,76.2 61.16,76.2 62.56,77.6 62.56,82.22 v62.23,82.55 | R9.1 67.53,82.55 v64.14,82.55
N$8
  Bottom 0.152: U2.13 47.62,89.53 44.66,92.5 R7.2 R8.1
N$9  (via drill 0.35)
  Top 0.152: v48.9,92.71 49.53,93.34 52.62,93.34 53.25,92.71 53.25,90.88 54.61,89.52 54.61,87 54.86,86.74 59.44,86.74 63.5,90.81 64.77,90.81 v66.67,88.9
  Bottom 0.152: R8.2 43.29,96.52 44.07,97.3 45.26,97.3 45.39,97.17 45.39,94.38 U2.14 48.97,92.63 v48.9,92.71 | v66.67,88.9 66.04,88.27 66.04,86.78 R10.1
N$10
  Bottom 0.152: R11.2 68.78,94.61 C3.1 73.03,92.92 R10.2
N$11
  Bottom 0.152: R12.2 67.53,96.52 78.73,96.52 C2.1 76.42,90.39 73.66,90.39 R9.2
N$12
  Bottom 0.152: U6.5 31.75,31.75 32.38,32.38 32.38,34.29 34.08,35.98 R21.2 R19.2
N$13
  Bottom 0.457: C4.1 92.08,106.05 TC_R.P$2
N$14
  Bottom 0.457: TC_R.P$3 C5.1
N$15
  Bottom 0.305: R84.1 78.79,15.29 76.2,12.7 66.97,12.7 U12.P$2
N$16
  Bottom 0.152: U6.6 31.75,30.48 34.08,32.8 34.08,33.02 | 34.08,33.02 R22.2 | 34.08,33.02 35.77,31.32 R23.1
N$17
  Bottom 0.152: R46.1 32.8,29.21 | 32.8,29.21 U6.7 | R23.2 34.08,30.48 32.8,29.21
N$18
  Bottom 0.152: R44.2 R45.1 21.8,30.48 U6.9
N$19
  Bottom 0.152: U6.8 22.44,29.21 R47.1 19.47,29.64 R45.2
N$20
  Bottom 0.152: R25.2 43.03,90.11 C7.1 40.78,84.75 40.78,76.22 22.02,76.22 16.41,81.83 16.41,83.53 15.47,84.47 15.47,86.98 14.59,87.86 13.35,87.86 11.43,85.95 11.43,24.05 M_S/R.P$3 M_S/R.P$4
N$21
  Bottom 0.152: C6.1 59.84,90.23 R20.2
N$22
  Bottom 0.152: U3.5 50.8,31.75 53.34,34.29 53.34,36.41 R30.2 R29.2
N$23
  Bottom 0.152: U3.6 50.8,30.48 53.34,33.02 | R31.2 54.4,34.08 53.34,33.02 | 53.34,33.02 54.19,33.02 R32.1
N$24
  Bottom 0.152: R27.1 49.31,45.45 C8.1
N$25
  Bottom 0.152: U3.12 44.03,34.29 R41.1 41.86,37.47 42.55,38.15 42.55,40.01 41.91,40.64 R42.2 40.79,40.7 C11.1
N$26
  Bottom 0.152: R35.1 53.12,29.21 | 53.12,29.21 U3.7 | R32.2 54.4,30.48 53.12,29.21
N$27
  Bottom 0.152: R33.2 R34.1 41.49,30.48 U3.9
N$28
  Bottom 0.152: U3.8 42.12,29.21 R36.1 40.85,29.41 R34.2
N$29  (via drill 0.35)
  Top 0.152: v73.03,55.88 74.93,55.88 v75.56,55.24
  Bottom 0.152: R37.2 73.66,54.5 74.99,55.82 | 74.99,55.82 77.42,58.26 77.42,67.34 C10.1 | R36.2 40.2,26.89 41.69,26.89 42.7,27.91 44.91,27.91 48.69,24.13 60.02,24.13 60.66,24.77 60.66,45.01 71.53,55.88 v73.03,55.88 | v75.56,55.24 74.99,55.82
N$30  (via drill 0.35)
  Top 0.152: v73.03,57.15 73.03,56.74 72.42,56.13 72.42,55.01 v71.88,54.47
  Bottom 0.152: C9.1 76.19,57.52 72.52,53.85 | 72.52,53.85 71.59,52.92 R38.2 | R35.2 57.15,27.94 60.35,31.14 60.35,45.13 71.4,56.19 72.06,56.19 v73.03,57.15 | v71.88,54.47 71.89,54.47 72.52,53.85
N$31
  Bottom 0.457: OUT_R.P$3 C10.2 79.81,67.1 79.81,57.71 80.39,57.12 83.34,57.12 85.09,58.87 85.09,64.77 85.72,65.41 R39.2
N$32
  Bottom 0.457: C9.2 83.19,62.85 83.19,67.94 85.09,69.85 | OUT_R.P$2 93.98,78.74 85.09,69.85 | R40.2 86.36,68.58 85.09,69.85
N$33
  Top 0.152: R52.1 U1.7 U1.6
N$34
  Bottom 0.152: R55.1 37.88,66.04 U4.2 U4.1
N$35
  Bottom 0.152: R56.1 26.25,59.69 U4.8 U4.9
N$36
  Top 0.152: U1.2 U1.1 R53.1
N$37
  Bottom 0.152: R59.1 37.88,59.69 U4.7 U4.6
N$38
  Bottom 0.152: R60.1 26.25,67.31 U4.14 U4.13
N$39  (1 unrouted)
  Top 0.152: U1.13 U1.14
N$42
  Bottom 0.152: R57.1 U5.1 U5.2
N$43
  Bottom 0.152: R61.1 41.49,60.96 U5.9 U5.8
N$44
  Bottom 0.152: U7.2 33.02,88.27 36.2,91.44 37.47,91.44 | 37.47,91.44 38.31,90.59 R63.2 | 37.47,91.44 38.31,92.29 R64.1
N$45
  Bottom 0.152: R58.1 U5.7 U5.6
N$46
  Bottom 0.152: R62.1 41.49,67.31 U5.14 U5.13
N$47
  Bottom 0.152: R63.1 36.62,88.63 C18.1
N$48
  Bottom 0.152: R65.2 37.05,80.01 | 37.05,80.01 36.2,80.01 34.29,81.92 34.29,82.55 33.66,83.19 U7.6 | 37.05,80.01 38.31,78.74 R66.1
N$49
  Bottom 0.152: R26.2 46.57,85.72 | 46.57,85.72 U2.10 | C7.2 45.3,87 46.57,85.72
N$50
  Bottom 0.152: C13.1 43.03,80.58 R43.1
N$51
  Bottom 0.152: C16.1 78.03,81.97 78.03,54.9 R48.2 79.16,52.07 68.58,52.07 61.27,44.76 61.27,24.31 60.45,23.5 48.26,23.5 44.45,27.3 44.42,27.28 42.93,27.28 39.15,23.5 23.91,23.5 R47.2
N$52
  Bottom 0.152: R49.2 76.83,57.24 77.73,58.14 77.73,74.66 C15.1 74.3,74.31 74.3,56.06 73.48,55.24 71.45,55.24 69.85,53.65 69.73,53.65 60.96,44.88 60.96,24.43 60.33,23.8 48.59,23.8 44.78,27.61 42.83,27.61 39.02,23.8 38.1,23.8 35.77,26.12 R46.2
N$53
  Bottom 0.457: OUT_L.P$3 95.25,95.88 83.19,83.82 C16.2 78.51,81.04 78.51,57.17 79.81,55.88 83.82,55.88 87,59.05 R50.2
N$54
  Bottom 0.457: OUT_L.P$2 88.9,86.36 88.9,83.81 C15.2 79.15,74.06 79.15,57.43 80.06,56.52 83.59,56.52 85.72,58.65 85.72,61.59 86.36,62.23 R51.2
N$55
  Bottom 0.457: TC_R.P$5 TC_R.P$4 85.72,106.05 C17.1
N$56
  Bottom 0.152: C19.1 38.25,82.92 R65.1
N$57
  Bottom 0.152: C20.1 23.01,81.92 U7.8 U7.9
N$60
  Bottom 0.152: C21.1 22.38,89.53 U7.14 U7.13
N$61
  Bottom 0.152: C20.2 20.17,83.76 R68.2 17.23,86.69 16.38,86.69 14.75,88.32 8.11,88.32 1.47,81.69 1.47,2.67 2.65,1.49 90.59,1.49 96.22,7.11 96.22,13.42 95.02,14.62 95.02,15.86 96.52,17.37 MONITOR.P$2
N$62
  Bottom 0.152: C21.2 20.17,87.06 R67.2 16.51,87 14.87,88.63 7.99,88.63 1.17,81.81 1.17,2.54 2.54,1.17 90.7,1.17 96.52,6.99 MONITOR.P$3
N$63
  Bottom 0.457: C29.1 89.86,45.4 | 89.86,45.4 93.99,49.53 MON_OUT.P$3 97.79,49.53 99.06,48.26 99.06,37.25 R70.1 | MON_IN.P$3 98.4,60.35 98.4,53.72 96.11,51.44 93.98,51.44 89.86,47.31 89.86,45.4
N$64
  Bottom 0.457: R69.1 98.42,39.79 98.42,44.45 97.16,45.72 MON_OUT.P$2 92.08,42.55 92.08,39.99 C28.1 87.63,39.38 87.63,48.26 88.27,48.9 90.17,48.9 93.34,52.07 95.89,52.07 97.79,53.98 97.79,58.42 96.52,59.69 MON_IN.P$2
N$66
  Bottom 0.152: R74.2 84.44,51.23 C29.2 83.82,45.09 81.92,43.18 81.92,33.02 86.14,28.79 R71.1
N$68
  Bottom 0.152: R73.2 87.03,48.72 87.03,39.41 84.45,36.83 84.44,36.84 C28.2 86.14,35.77 R72.2
N$70
  Bottom 0.152: U11.3 75.35,37.47 R77.2 75.98,34.29 71.75,34.29 71.12,33.66 71.12,31.75 75.87,27 88.59,27 89.53,27.94 89.53,30.06 R72.1
N$72
  Bottom 0.152: U11.2 74.08,38.73 R75.1 78.11,41.06 78.11,38.1 78.74,37.47 80.01,37.47 81.61,35.87 81.61,30.79 85.09,27.3 86.58,27.3 R71.2
N$73
  Bottom 0.152: U11.6 75.98,33.66 R78.2 77.25,34.19 77.98,34.91 77.98,36.2 77.25,36.93 R79.1
N$74
  Bottom 0.152: R77.1 R78.1 78.95,31.96 78.11,31.11 76.2,31.11 74.93,32.38 U11.7
N$75
  Bottom 0.152: R79.2 R75.2 77.69,43.18 76.83,43.18 | 76.83,43.18 73.66,40.01 U11.1 | R76.1 77.25,43.6 76.83,43.18
N$77
  Bottom 0.152: R80.1 64.98,33.66 U11.9 U11.8
N$80
  Bottom 0.152: R81.1 64.98,38.73 U11.13 U11.14
PRE_TC  (1 unrouted)
  Bottom 0.152: C17.2 76.44,108.83 65.02,108.83 57.15,100.97 57.15,92.71 59.05,90.81 59.05,88.9 | R3.1 59.91,88.05 59.05,88.9 | 59.05,88.9 57.93,87.77 57.5,87.77 56.08,86.36 52.97,86.36 52.62,86.01 52.62,81.24 52.02,80.64 50.66,80.64 48.97,82.33 U2.8 50.16,83.19 51.21,84.23 51.21,87.86 50.16,88.9 47.62,88.9 43.18,93.34 R7.1
SELECTOR  (via drill 0.35)  (1 unrouted)
  Top 0.152: U13.10 37.69,49.12 v40.01,51.44 42.33,49.12 U13.11 43.18,48.76 v43.18,45.72 | v36.83,57.78 36.83,55.18 U13.1 | v43.18,57.15 43.54,56.79 U13.20 | U14.6 41.61,36.01 42.43,36.01 42.65,36.23 v43.15,36.23
  Bottom 0.152: v36.83,57.78 37.49,57.12 38.99,57.12 40.01,56.1 40.01,55.88 | v40.01,51.44 40.01,55.88 | 40.01,55.88 41.27,57.15 v43.18,57.15 | v43.15,36.23 43.21,36.29 43.21,38.99 43.51,39.29 43.51,45.39 v43.18,45.72
SR_BYP_CH1  (via drill 0.35)
  Top 0.152: CH1:R5.2 24.13,79.59 | 24.13,79.59 CH1:R8.1 | CH1:R10.2 CH1:R5.2 | CH1:U2.1 28.74,76.25 CH1:R5.2 | v38.73,56.52 38.41,56.19 38.41,52.09 37.56,51.25 36.79,51.25 U13.7 | v28.57,56.52 23.5,61.59 23.5,78.95 24.13,79.59
  Bottom 0.152: v38.73,56.52 v28.57,56.52
SR_BYP_CH2  (via drill 0.35)
  Top 0.152: CH2:R8.1 CH2:R5.2 | CH2:R5.2 CH2:R10.2 | CH2:R5.2 48.37,79.48 | 48.37,79.48 51.65,76.2 CH2:U2.1 | U13.4 36.79,53.2 37.56,53.2 38.1,53.74 38.1,58.87 43.39,64.16 v46.8,64.16 | v48.35,76.05 46.99,77.41 46.99,78.74 47.73,79.48 48.37,79.48
  Bottom 0.152: v46.8,64.16 46.99,64.36 46.99,68.58 45.91,69.66 45.91,73.2 48.35,75.64 v48.35,76.05
SR_BYP_CH3
  Top 0.152: CH3:R5.2 CH3:R10.2 | CH3:R5.2 67.33,78.93 CH3:R8.1 | CH3:R5.2 74.04,76.01 CH3:U2.1 | CH3:R5.2 68.91,76.72 68.91,66.37 67.61,65.08 53.21,65.08 48.59,60.45 48.59,54.57 45.09,51.06 U13.14
SR_OUT_CH1
  Top 0.152: CH1:R17.2 35.33,49.77 U13.9
SR_OUT_CH2
  Top 0.152: CH2:R17.2 34.82,54.31 U13.2
SR_OUT_CH3
  Top 0.152: CH3:R17.2 47.17,49.77 U13.12
SR_SEL_CH1
  Top 0.152: CH1:R16.1 32.85,50.41 U13.8
SR_SEL_CH2
  Top 0.152: CH2:R16.1 32.92,53.66 U13.3
SR_SEL_CH3
  Top 0.152: CH3:R16.1 46.39,50.41 U13.13
TC_OUT+
  Bottom 0.457: TC_S.P$2 71.12,106.06 74.93,102.25 78.11,102.25 C2.2 78.73,97.79 68.58,97.79 67.94,98.42 R14.2
TC_OUT-
  Bottom 0.457: TC_S.P$3 71.75,102.23 71.75,100.97 C3.2 68.15,99.7 R13.2
VDD  (via drill 0.35)  (18 unrouted)
  Top 0.305: CH1:U2.5 28.61,71.17 27.94,71.84 v27.94,72.39 | v42.55,70.48 42.55,73.66 | 42.55,73.66 42.55,78.11 41.27,79.38 | CH1:R14.1 41.06,79.59 41.27,79.38 | 41.27,79.38 41.27,83.71 v41.39,83.82 41.39,85.84 43.18,87.63 43.18,90.81 | v50.6,86.36 59.05,86.36 v61.59,83.82 | v61.59,83.82 64.14,86.36 v64.14,89.53 | CH3:R14.1 87.63,81.5 87.63,87 | 87,91.44 87.63,90.81 87.63,87 | 87.63,87 84.79,87 81.92,84.12 81.92,79.38 | v70.29,65.38 70.29,65.35 70.48,65.15 74.77,65.15 78.11,68.48 78.11,69.22 76.39,70.93 CH3:U2.5 73.85,70.93 v73.67,71.11 | v60.33,46.35 62.87,43.81 v67.31,43.81 | v61.59,83.82 61.59,82.88 61.55,82.83 61.55,79.64 CH2:R14.1 62.23,78.74 63.09,77.88 63.09,71.81 v63.5,71.4 | CH2:U2.5 51.1,71.12 50.12,72.11 50.12,73.07 49.53,73.66 42.55,73.66
  Top 0.457: v27.94,27.94 v37.47,27.94 38.72,27.94 41.28,25.39 44.88,25.39 46.79,27.3 v46.99,27.3 53.98,34.29 v58.42,34.29 65.41,34.29 | 65.41,34.29 69.85,34.29 70.48,33.66 v70.48,29.84 | 65.41,34.29 65.41,41.91 v67.31,43.81 | CH3:U2.5 76.64,70.93 78.21,72.49 78.21,75.67 81.92,79.38
  Bottom 0.305: v27.94,72.39 28.13,72.39 29.55,73.81 35.48,73.81 39.47,69.83 41.89,69.83 v42.55,70.48 | v41.39,83.82 R26.1 43.81,84.67 43.81,87.63 44.45,88.27 U2.12 50.16,88.27 50.8,87.63 50.8,86.56 v50.6,86.36 | v61.59,83.82 R4.1 R5.1 | v64.14,89.53 64.14,90.81 | v70.29,65.38 70.29,55.69 60.96,46.35 v60.33,46.35 | v63.5,71.4 66.83,71.4 66.9,71.47 72.34,71.47 72.74,71.07 73.31,71.07 73.35,71.11 v73.67,71.11
  Bottom 0.457: C12.1 45.11,40.46 45.11,39.75 45.61,39.26 45.61,37.27 U3.14 U3.13 46.35,35.56 46.99,34.92 46.99,32.38 46.35,31.75 | U6.10 26.67,31.75 27.94,30.48 v27.94,27.94 | v37.47,27.94 37.47,33.02 36.2,34.29 R22.1 R21.1 | U3.10 46.35,31.75 | 46.35,31.75 46.99,31.11 v46.99,27.3 | v58.42,34.29 R31.1 R30.1 | v70.48,29.84 70.48,33.67 71.57,34.75 71.58,34.75 71.75,34.92 U11.5 | v67.31,43.81 73.66,50.16
  other vias: 87.63,93.34
  pour Top: 40.01,97.79 40.01,90.17 46.35,90.17 46.35,97.79
  pour Top: 84.45,97.79 84.45,90.17 88.27,90.17 88.27,97.79
  pour Bottom: 69.22,52.07 81.28,52.07 81.92,52.07 81.92,54.61 89.53,54.61 89.53,50.8 89.53,50.16 89.53,49.53 69.22,49.53 68.58,49.53 68.58,52.07
  pour Bottom: 92.08,95.89 85.09,95.89 85.09,92.71 91.44,92.71 92.71,93.98 92.71,95.89
  pour Bottom: 65.41,88.9 65.41,96.52 62.23,96.52 62.23,88.9
VEE  (via drill 0.35)
  Top 0.457: v81.28,88.27 81.28,87.63 80.01,86.36 71.12,86.36 65.41,92.08 | v62.87,99.06 59.39,99.06 57.56,100.89 55.14,100.89 51.3,104.72 48.95,104.72 44.99,108.68 16.6,108.68 13.97,106.05 13.97,103.5 21.59,95.89
  Bottom 0.457: R70.2 96.08,32.61 100.74,32.61 108.07,39.93 108.07,69.73 106.05,71.75 | 90.81,68.58 93.98,71.75 106.05,71.75 | 106.05,71.75 106.05,72.39 108.07,74.42 108.07,88.97 97.47,99.57 94.61,99.57 92.71,97.66 92.71,94.2 86.78,88.27 v81.28,88.27
  pour Top: 20.95,97.79 24.13,97.79 24.13,90.17 20.95,90.17
  pour Top: 62.23,99.69 62.23,90.81 67.94,90.81 67.94,99.69
  pour Bottom: 95.25,38.73 95.25,33.02 92.71,33.02 92.71,38.73
  pour Bottom: 88.27,69.85 88.27,57.15 91.44,57.15 91.44,70.48 88.27,70.48
  pour Bottom: 65.41,102.87 65.41,97.16 62.23,97.16 62.23,102.87
VOL1_P2_CH1  (1 unrouted)
VOL1_P2_CH2  (1 unrouted)
VOL1_P2_CH3  (1 unrouted)
VOL1_P3
  Bottom 0.152: R24.2 58.2,93.41 C6.2 58.34,93.27 59.13,94.06 60.88,94.06 62.87,92.08 62.87,77.47 60.96,75.56 57.38,75.56 53.29,79.65 49.37,79.65 45.64,75.92 21.89,75.92 16.11,81.71 16.11,82.78 16.09,82.8 16.09,83.43 14.85,84.67 13.09,84.67 11.76,83.33 11.76,27.53 M_S/R.P$2
VOL1_P3_CH1
  Top 0.152: CH1:R16.2 28.03,53.03 10.92,53.03 8.62,50.73 8.19,50.73 U8.15
VOL1_P3_CH2
  Top 0.152: CH2:R16.2 10.79,53.34 8.49,51.04 5.96,51.04 U8.8
VOL1_P3_CH3
  Top 0.152: CH3:R16.2 50.8,51.02 50.8,47.62 47.32,44.15 26.54,44.15 24.46,46.23 24.46,50.67 23.04,52.09 11.43,52.09 10.79,51.46 | 10.79,51.46 10.79,51.44 | 10.79,51.46 9.03,49.7 9.03,47.08 7.34,45.39 U8.13